# Altium project 100857_project.prjpcb
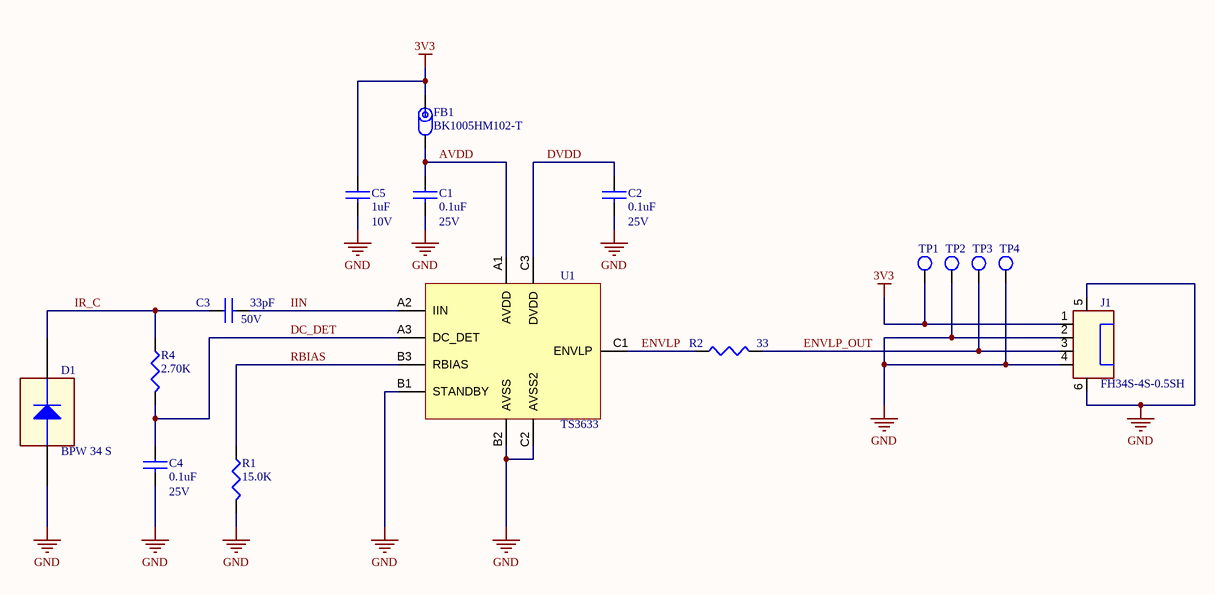
[diagram p0: Sensor.SchDoc]
Board_Name: Chicklet Indian Rev D; Board_Number: 100857; PCB_Revision: 03; Project_Name: Watchman; Sch_Revision: 03
2 sheets, 16 parts. Net scope: global (net labels, ports and power ports of the same name join across sheets).
Board files: 606-100857.PcbDoc, 606-100857_Stripped.PcbDoc, 100857_Panelized_8x10.PcbDoc
Sheets:
  Sensor.SchDoc
  RevisionLog.SchDoc

## Sheet Sensor.SchDoc: IR Sensor
size 431 x 279 mm; DrawnBy: Doug; Organization: Synapse Product Development, LLC.; Address1: 1511 6th Ave., Suite 400; Address2: Seattle, Washington 98101; Address3: 206.381.0898; Address4: www.synapse.com; SheetNumber: 1; SheetTotal: 2; PageSetup: Record=PageOptions|CenterHorizontal=True|CenterVertical=True|PrintScale=1.06|XCorrection=1.00|YCorrection=1.00|PrintKind=1|BorderSize=5000000|LeftOffset=0|BottomOffset=0|Orientation=2|PaperLength=4318|PaperWidth=2794|Scale=100|PaperSource=7|PrintQuality=200|MediaType=1|DitherType=10|PrintScaleMode=1|PaperKind=11x17|PaperIndex=3

### Parts
C1  0.1uF  Voltage: 25V  [0402-IPCsm_55]
C2  0.1uF  Voltage: 25V  [0402-IPCsm_55]
C3  33pF  Voltage: 50V  [0201-IPCsm_33]
C4  0.1uF  Voltage: 25V  [0402-IPCsm_55]
C5  1uF  Voltage: 10V  [0402-IPCsm_55]
D1  BPW 34 S  [PHOTODIODE_OSRAM_BPW34S]
FB1  BK1005HM102-T  [ind-0402_55]
J1  FH34S-4S-0.5SH  [con_hirose_FH34SRJ-4S]
R1  15.0K  [0201-IPCsm_26]
R2  33  [0201-IPCsm_26]
R4  2.70K  [0201-IPCsm_26]
TP1  tp-1mm  [TP-S100_SMT]  (value not drawn)  (no BOM)
TP2  tp-1mm  [TP-S100_SMT]  (value not drawn)  (no BOM)
TP3  tp-1mm  [TP-S100_SMT]  (value not drawn)  (no BOM)
TP4  tp-1mm  [TP-S100_SMT]  (value not drawn)  (no BOM)
U1  TS3633  [BGA9_166X166X61_50p]

### Nets
3V3: C5.1 FB1.1 J1.1 TP1.1(TP)
GND: C1.2 C2.2 C4.2 C5.2 D1.1 J1.2 J1.4 J1.5(TAB1) J1.6(TAB2) R1.2 TP2.1(TP) TP4.1(TP) U1.B1(STANDBY) U1.B2(AVSS) U1.C2(AVSS2)
AVDD: C1.1 FB1.2 U1.A1(AVDD)
DC_DET: C4.1 R4.2 U1.A3(DC_DET)
DVDD: C2.1 U1.C3(DVDD)
ENVLP: R2.1 U1.C1(ENVLP)
ENVLP_OUT: J1.3 R2.2 TP3.1(TP)
IIN: C3.2 U1.A2(IIN)
IR_C: C3.1 D1.2 R4.1
RBIAS: R1.1 U1.B3(RBIAS)

### Notes on the sheet
- Design Notes:
- Layout Notes:
- Project:
- Sheet Title:
- PCBA:
- PROPRIETARY AND CONFIDENTIAL
- Drawn by:
- Schematic Part Number:
- Schematic Revision:
- Date:
- Sheet:
- /

### Library data of the parts
C1 C2 C4 = TMK105BJ104KV-F: CAP CER .10UF 25V X5R 0402; part_type: capacitor; id: 710; mfg: Taiyo Yuden; dist: Digikey; dist_pn: 587-1456-1-ND; source_package: C_0.1uF_25V_0402; tolerance: 10%; TableName: viewAltiumCapacitors; mfg_pn: TMK105BJ104KV-F; type: X5R; height: 0.55MM; status: Unknown
C3 = CGA1A2C0G1H330J030BA: CAP CER 33PF 50V 5% C0G 0201; part_type: capacitor; id: 1364; mfg: TDK Corporation; dist: Digikey; dist_pn: 445-9030-6-ND; source_package: C_33p_25V_C0G_0201; type: C0G, NPO; TableName: viewAltiumCapacitors; allegro_footprint: 0201-IPCsm_33,c-0201_13H; symbol: MASTER_DISCRETE\CAP; mfg_pn: CGA1A2C0G1H330J030BA; tolerance: 5%; height: 0.33MM; status: Good
C5 = GRM155R61A105KE15D: CAP CER 1UF 10V 10% X5R 0402; part_type: capacitor; id: 793; mfg: MURATA; dist: DIGIKEY; dist_pn: 490-3890-1-ND; source_package: C_1U_10V_X5R_0402; TableName: viewAltiumCapacitors; mfg_pn: GRM155R61A105KE15D; type: X5R; tolerance: 10%; height: 0.55MM; status: Unknown
D1 = BPW 34 S: PHOTODIODE PIN HI SPEED HI SENS; id: 1217; mfg: OSRAM; dist: Digikey; dist_pn: 475-2659-6-ND; voltage: 32V; type: 400nm ~ 1100nm; TableName: viewAltiumDiscretes; mfg_pn: BPW 34 S; part_type: Photodiode; height: 1.3mm; status: Unknown
FB1 = BK1005HM102-T: FERRITE BEAD 1000 OHM 0402; part_type: ferrite_bead; id: 687; mfg: Taiyo Yuden; dist: Digikey; dist_pn: 587-1835-6-ND; current: 150mA; TableName: viewAltiumInductors; mfg_pn: BK1005HM102-T; height: 0.55mm; status: Unknown
J1 = FH34S-4S-0.5SH: CONN FFC FPC 4POS 0.50MM R/A; part_type: ffc/fpc; id: 1604; mfg: HIROSE; dist: MOUSER; dist_pn: 798-FH34S-4S-0.5SH50; positions: 4; layout_notes: Top Contacts; TableName: viewAltiumConnectors; mfg_pn: FH34S-4S-0.5SH; height: 1.1mm; status: Unknown
R1 = ERJ-1GEF1502C: RES 15.0K OHM 1/20W 1% 0201 SMD; part_type: resistor; Tolerance: 1.00%; DIST: Digikey; MFG: Panasonic; DIST_PN: P15.0KABCT-ND; id: 1730; source_package: R_15K_1p_0201; TableName: viewAltiumResistors; Height: 0.26mm; MFG_PN: ERJ-1GEF1502C; status: Unknown
R2 = RC0201FR-0733R: RES 33 OHM 1/20W 1% 0201 SMD; part_type: resistor; Tolerance: 1.00%; Voltage: 50V; DIST: DIGIKEY; MFG: YAGEO; DIST_PN: 311-33.0MCT-ND; Power: 0.05W; id: 1544; source_package: R_33_0201_1P; TableName: viewAltiumResistors; Height: .26MM; MFG_PN: RC0201FR-0733R; status: Unknown
R4 = ERJ-1GEF2701C: RES 2.70K OHM 1/20W 1% 0201 SMD; part_type: resistor; Tolerance: 1.00%; DIST: DIGIKEY; MFG: PANASONIC; DIST_PN: P2.70KABCT-ND; id: 1980; source_package: R_ 2K70_1P_0201; TableName: viewAltiumResistors; Height: 0.26MM; MFG_PN: ERJ-1GEF2701C; status: Unknown
TP1-TP4 = TP0042: TESTPOINT, 1MM SMD, Square pad, Round SM opening; part_type: test_point; mfg_pn: TP0042; id: 888; mfg: NA; TableName: viewAltiumMisc; dist: NA; dist_pn: NA; source_package: tp_smt; status: Unknown
U1 = TS3633: Optical Receiver for VR Gaming System; part_type: IC; id: 2509; mfg: Triad Semiconductor; dist: CONSIGNED; TableName: viewAltiumIcs; mfg_pn: TS3633; dist_pn: TS3633; status: Unknown

## Sheet RevisionLog.SchDoc: Revision Log
size 431 x 279 mm; DrawnBy: Doug; Organization: Synapse Product Development, LLC.; Address1: 1511 6th Ave., Suite 400; Address2: Seattle, Washington 98101; Address3: 206.381.0898; Address4: www.synapse.com; SheetNumber: 2; SheetTotal: 2; PageSetup: Record=PageOptions|CenterHorizontal=True|CenterVertical=True|PrintScale=1.06|XCorrection=1.00|YCorrection=1.00|PrintKind=1|BorderSize=5000000|LeftOffset=0|BottomOffset=0|Orientation=2|PaperLength=4318|PaperWidth=2794|Scale=100|PaperSource=7|PrintQuality=200|MediaType=1|DitherType=10|PrintScaleMode=1|PaperKind=11x17|PaperIndex=3
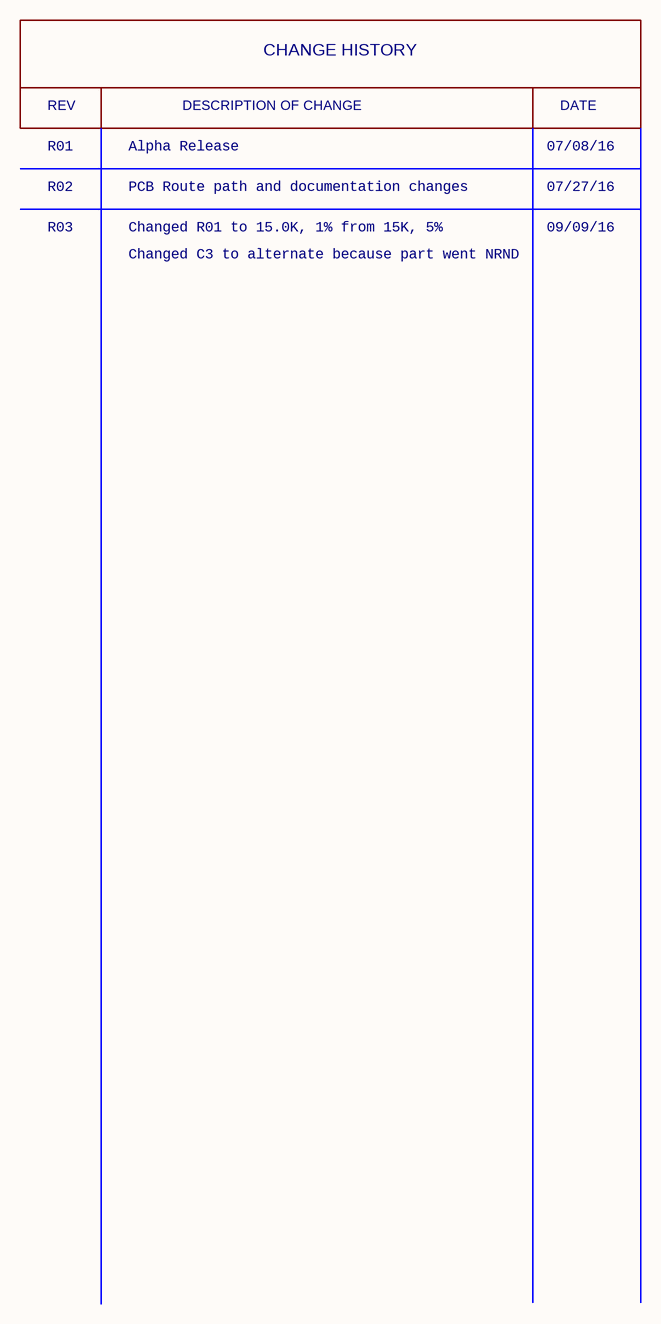
[diagram p1: RevisionLog.SchDoc]

### Notes on the sheet
- CHANGE HISTORY
- REV
- R01
- Alpha Release
- DESCRIPTION OF CHANGE
- 07/08/16
- DATE
- R02
- R03
- PCB Route path and documentation changes
- Changed R01 to 15.0K, 1% from 15K, 5%
- 07/27/16
- 09/09/16
- Changed C3 to alternate because part went NRND
- Design Notes:
- Layout Notes:
- Project:
- Sheet Title:
- PCBA:
- PROPRIETARY AND CONFIDENTIAL
- Drawn by:
- Schematic Part Number:
- Schematic Revision:
- Date:
- Sheet:
- /